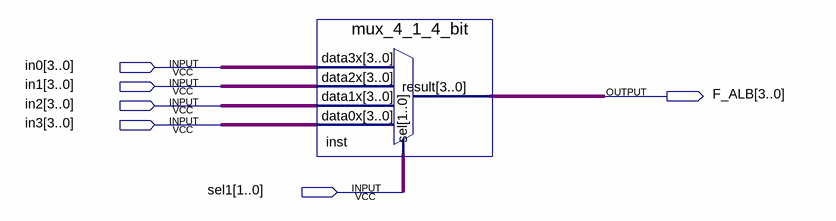
[diagram p0: schematic sheet]
// Quartus schematic mux_4_1_4bit.bdf as structural Verilog: 1 symbols, 6 pins
module mux_4_1_4bit (
  input  [3:0] in0,
  input  [3:0] in1,
  input  [3:0] in2,
  input  [3:0] in3,
  input  [1:0] sel1,
  output [3:0] F_ALB
);

  mux_4_1_4_bit inst (.data3x(in0), .data2x(in1), .data1x(in2), .data0x(in3), .sel(sel1), .result(F_ALB));
endmodule
